# EAGLE schematic mwscoretransponder (EAGLE 6.0)
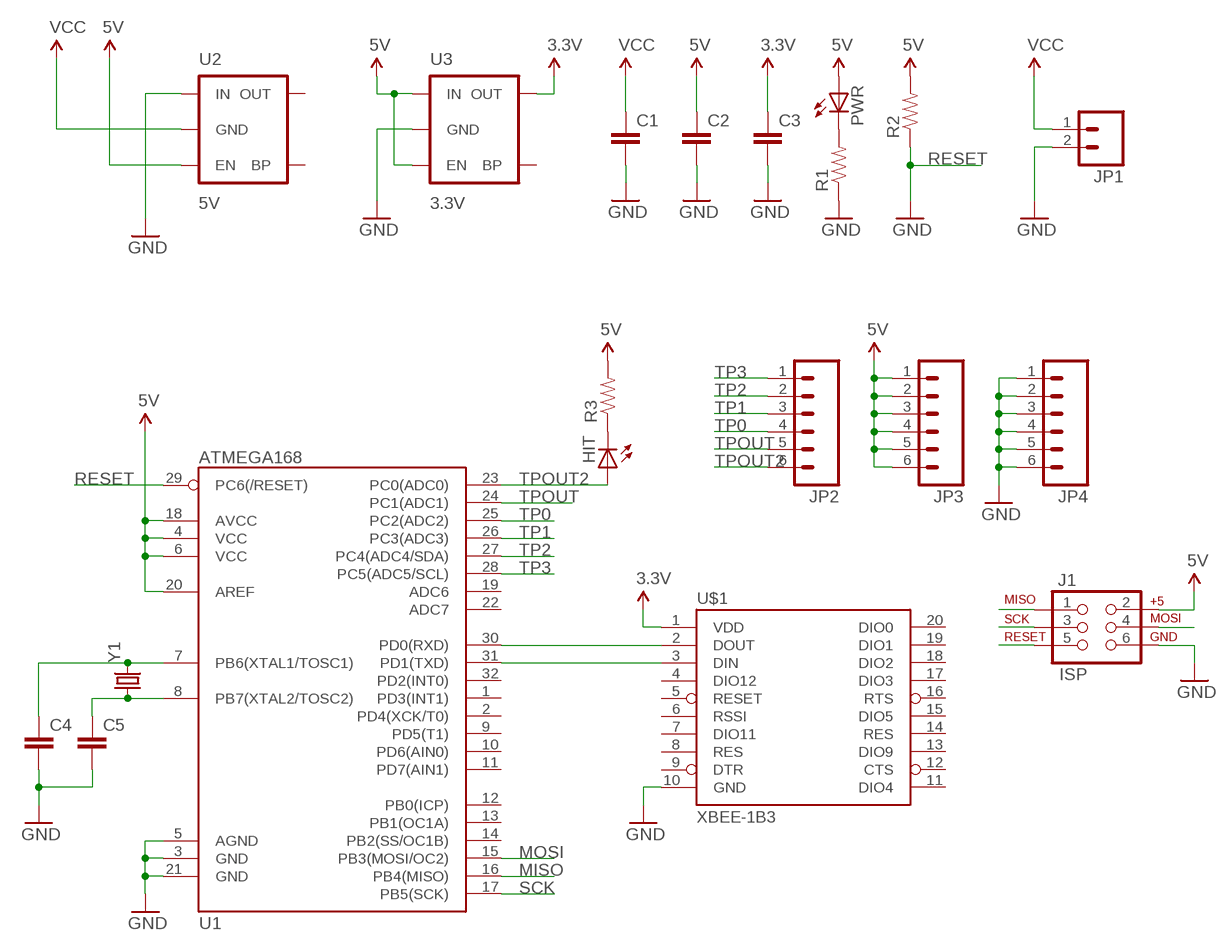
[diagram p0: schematic, sheet 1]

## Parts
C1  CAP0603-CAP  [0603-CAP]
C2  CAP0603-CAP  [0603-CAP]
C3  CAP0603-CAP  [0603-CAP]
C4  CAP0603-CAP  [0603-CAP]
C5  CAP0603-CAP  [0603-CAP]
HIT  LED0603  [LED-0603]
J1  ISP  AVR_SPI_PRG_6PTH  [2X3]
JP1  M023.5MM-NO_SILK  [SCREWTERMINAL-3.5MM-2-NS]
JP2  M06SIP  [1X06]
JP3  M06SIP  [1X06]
JP4  M06SIP  [1X06]
PWR  LED0603  [LED-0603]
R1  RESISTOR0603-RES  [0603-RES]
R2  RESISTOR0603-RES  [0603-RES]
R3  RESISTOR0603-RES  [0603-RES]
U1  ATMEGA168  [TQFP32-08]
U2  5V  V_REG_LDOSMD  [SOT23-5]
U3  3.3V  V_REG_LDOSMD  [SOT23-5]
U$1  XBEE-1B3  [XBEE-SMD]
Y1  CRYSTALSMD  [HC49UP]

## Nets
3.3V: C3.1 U3.5(OUT) U$1.1(VDD)
5V: C2.1 J1.2 JP3.1 JP3.2 JP3.3 JP3.4 JP3.5 JP3.6 PWR.A R2.2 R3.2 U1.4(VCC) U1.6(VCC) U1.18(AVCC) U1.20(AREF) U2.3(EN) U3.1(IN) U3.3(EN)
GND: C1.2 C2.2 C3.2 C4.2 C5.2 J1.6 JP1.2 JP4.1 JP4.2 JP4.3 JP4.4 JP4.5 JP4.6 R1.1 U1.3(GND) U1.5(AGND) U1.21(GND) U2.1(IN) U3.2(GND) U$1.10(GND)
MISO: J1.1 U1.16(PB4(MISO))
MOSI: J1.4 U1.15(PB3(MOSI/OC2))
N$1: PWR.C R1.2
N$2: C4.1 U1.7(PB6(XTAL1/TOSC1)) Y1.2
N$3: C5.1 U1.8(PB7(XTAL2/TOSC2)) Y1.1
N$4: HIT.C R3.1
N$5: U1.30(PD0(RXD)) U$1.2(DOUT)
N$6: U1.31(PD1(TXD)) U$1.3(DIN)
RESET: J1.5 R2.1 U1.29(PC6(/RESET)) ; supply symbol labelled GND
SCK: J1.3 U1.17(PB5(SCK))
TP0: JP2.4 U1.25(PC2(ADC2))
TP1: JP2.3 U1.26(PC3(ADC3))
TP2: JP2.2 U1.27(PC4(ADC4/SDA))
TP3: JP2.1 U1.28(PC5(ADC5/SCL))
TPOUT: JP2.5 U1.24(PC1(ADC1))
TPOUT2: HIT.A JP2.6 U1.23(PC0(ADC0))
VCC: C1.1 JP1.1 U2.2(GND)
Unconnected: U1.1(PD3(INT1)) U1.2(PD4(XCK/T0)) U1.9(PD5(T1)) U1.10(PD6(AIN0)) U1.11(PD7(AIN1)) U1.12(PB0(ICP)) U1.13(PB1(OC1A)) U1.14(PB2(SS/OC1B)) U1.19(ADC6) U1.22(ADC7) U1.32(PD2(INT0)) U2.4(BP) U2.5(OUT) U3.4(BP) U$1.4(DIO12) U$1.5(RESET) U$1.6(RSSI) U$1.7(DIO11) U$1.8(RES) U$1.9(DTR) U$1.11(DIO4) U$1.12(CTS) U$1.13(DIO9) U$1.14(RES) U$1.15(DIO5) U$1.16(RTS) U$1.17(DIO3) U$1.18(DIO2) U$1.19(DIO1) U$1.20(DIO0)

## Library data of the parts
C1-C5 = SparkFun:CAP: Capacitor Standard 0603 ceramic capacitor, and 0.1" leaded capacitor.
HIT PWR = SparkFun:LED: LEDs Standard schematic elements and footprints for 5mm, 3mm, 1206, and 0603 sized LEDs. 5mm - Spark Fun Electronics SKU : COM-00529 (and others)
J1 = SparkFun:AVR_SPI_PRG_6: AVR ISP 6 Pin This is the reduced ISP connector for AVR programming. Common on Arduino. This footprint will take up less PCB space and can be used with a 10-pin to 6-pin adapter such as SKU: BOB-08508
JP1 = SparkFun:M02: Header 2 Standard 2-pin 0.1" header. Use with straight break away headers (SKU : PRT-00116), right angle break away headers (PRT-00553), swiss pins (PRT-00743), machine pins (PRT-00117), and female headers (PRT-00115). Molex polarized connector foot print use with SKU : PRT-08233 with associated crimp pins and housings.
JP2-JP4 = SparkFun:M06: Header 6 Standard 6-pin 0.1" header. Use with straight break away headers (SKU : PRT-00116), right angle break away headers (PRT-00553), swiss pins (PRT-00743), machine pins (PRT-00117), and female headers (PRT-00115). Molex polarized connector foot print use with SKU : PRT-08094 with associated crimp pins and housings. NOTES ON THE VARIANTS LOCK and LOCK_LONGPADS... This footprint was designed to help hold the alignment of a through-hole component (i.e. 6-pin header) while soldering it into place. You may notice that each hole has been shifted either up or down by 0.005 of an inch from it's more standard position (which is a perfectly straight line). This slight alteration caused the pins (the squares in the middle) to touch the edges of the holes. Because they are alternating, it causes a "brace" to hold the component in place. 0.005 has proven to be the perfect amount of "off-center" position when using our standard breakaway headers. Although looks a little odd when you look at the bare footprint, once you have a header in there, the alteration is very hard to notice. Also, if you push a header all the way into place, it is covered up entirely on the bottom side. This idea of altering the position of holes to aid alignment will be further integrated into the Sparkfun Library for other footprints. It can help hold any component with 3 or more connection pins.
R1-R3 = SparkFun:RESISTOR: Resistor Basic schematic elements and footprints for 0603, 1206, and PTH resistors.
U1 = SparkFun:ATMEGA168
U2 U3 = SparkFun:V_REG_LDO: Voltage Regulator LDO Standard 150mA LDO voltage regulator in SOT-23 layout. Micrel part MIC5205. BP (by-pass) pin is used to lower output noise with 470pF cap.
U$1 = SparkFun:XBEE-1
Y1 = SparkFun:CRYSTAL: Crystals Various standard crystals. Proven footprints. Spark Fun Electronics SKU : COM-00534